# Altium schematic sheet LINE_PREAMP.SchDoc: =DocumentName
size 297 x 209 mm; CompanyName: "AS Manufacturing" LLC; Organization: "AS Manufacturing" LLC; Address1: 5 Sklyarenka St.; Address2: Kyiv 04073; Address3: Ukraine; Address4: https://ajax.systems/en/; DocumentNumber: 6; SheetNumber: 6; SheetTotal: 7; Template_version: 1.0.1
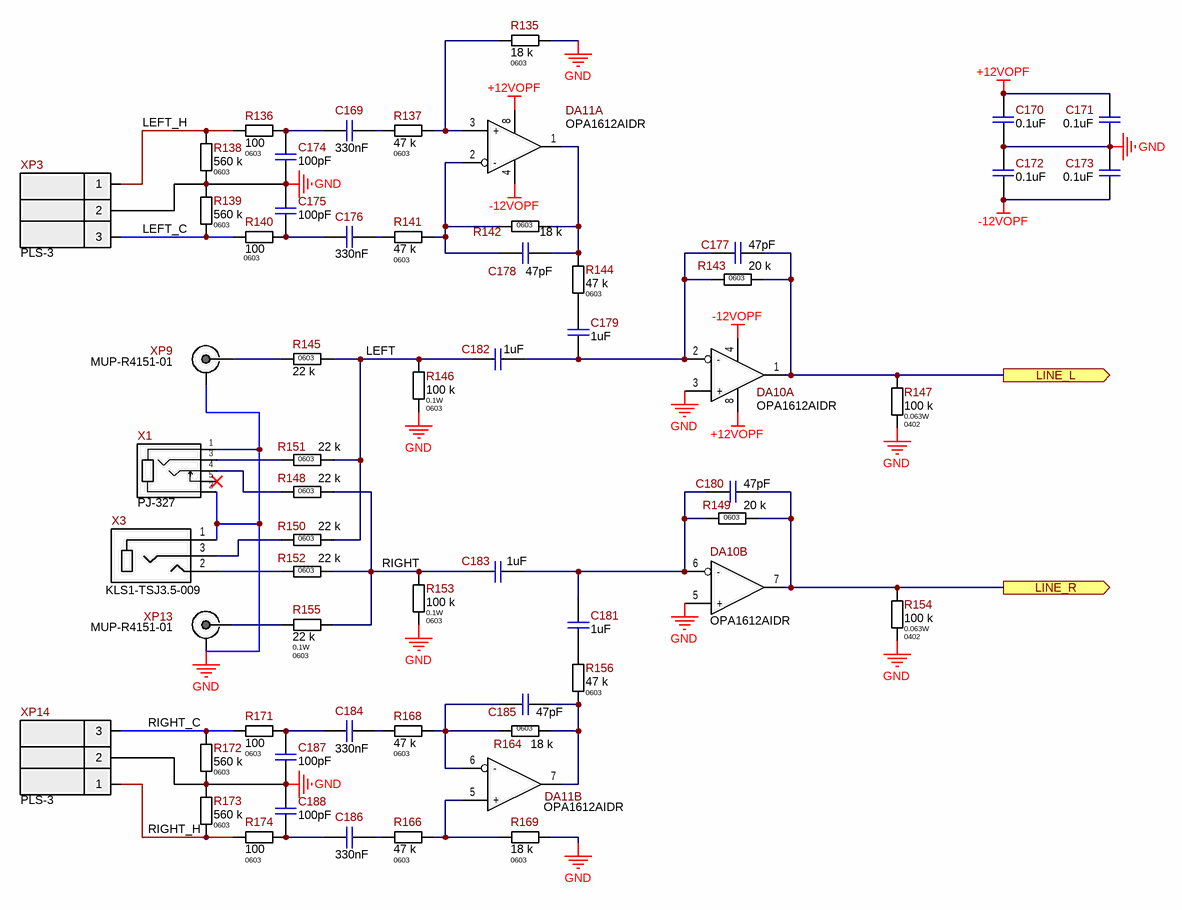
[diagram p0: LINE_PREAMP.SchDoc]

## Parts
C169  330nF  [WIMA_2,5x6,5x7,2]
C170  0.1uF  [C0402(1005)]
C171  0.1uF  [C0402(1005)]
C172  0.1uF  [C0402(1005)]
C173  0.1uF  [C0402(1005)]
C174  100pF  [C0402(1005)]
C175  100pF  [C0402(1005)]
C176  330nF  [WIMA_2,5x6,5x7,2]
C177  47pF  [C0603(1608)]
C178  47pF  [C0603(1608)]
C179  1uF  [WIMA5]
C180  47pF  [C0603(1608)]
C181  1uF  [WIMA5]
C182  1uF  [WIMA5]
C183  1uF  [WIMA5]
C184  330nF  [WIMA_2,5x6,5x7,2]
C185  47pF  [C0603(1608)]
C186  330nF  [WIMA_2,5x6,5x7,2]
C187  100pF  [C0402(1005)]
C188  100pF  [C0402(1005)]
DA10  OPA1612AIDR  [SOIC8]  (parts A,B of 2)
DA11  OPA1612AIDR  [SOIC8]  (parts A,B of 2)
R135  18 k  Package/Case: 0603  [R0603]
R136  100  Package/Case: 0603  [R0603]
R137  47 k  Package/Case: 0603  [R0603]
R138  560 k  Package/Case: 0603  [R0603]
R139  560 k  Package/Case: 0603  [R0603]
R140  100  Package/Case: 0603  [R0603]
R141  47 k  Package/Case: 0603  [R0603]
R142  18 k  Package/Case: 0603  [R0603]
R143  20 k  Package/Case: 0603  [R0603]
R144  47 k  Package/Case: 0603  [R0603]
R145  22 k  Package/Case: 0603  [R0603]
R146  100 k  Power Rating: 0.1W  Package/Case: 0603  [R0603]
R147  100 k  Power Rating: 0.063W  Package/Case: 0402  [R0402]
R148  22 k  Package/Case: 0603  [R0603]
R149  20 k  Package/Case: 0603  [R0603]
R150  22 k  Package/Case: 0603  [R0603]
R151  22 k  Package/Case: 0603  [R0603]
R152  22 k  Package/Case: 0603  [R0603]
R153  100 k  Power Rating: 0.1W  Package/Case: 0603  [R0603]
R154  100 k  Power Rating: 0.063W  Package/Case: 0402  [R0402]
R155  22 k  Power Rating: 0.1W  Package/Case: 0603  [R0603]
R156  47 k  Package/Case: 0603  [R0603]
R164  18 k  Package/Case: 0603  [R0603]
R166  47 k  Package/Case: 0603  [R0603]
R168  47 k  Package/Case: 0603  [R0603]
R169  18 k  Package/Case: 0603  [R0603]
R171  100  Package/Case: 0603  [R0603]
R172  560 k  Package/Case: 0603  [R0603]
R173  560 k  Package/Case: 0603  [R0603]
R174  100  Package/Case: 0603  [R0603]
X1  PJ-327  [PJ-327A]
X3  (no value)  [KLS1-TSJ3.5-009]
XP3  PLS-3  [3x-2.54]
XP9  MUP-R4151-01  [U.FL-R-SMT(10)_REC]
XP13  MUP-R4151-01  [U.FL-R-SMT(10)_REC]
XP14  PLS-3  [3x-2.54]

## Ports
LINE_L (out), LINE_R (out)

## Nets
+12VOPF: C170.1 C171.1 DA10.8(V+) DA11.8(V+)
-12VOPF: C172.2 C173.2 DA10.4(V-) DA11.4(V-)
GND: C170.2 C171.2 C172.1 C173.1 C174.2 C175.2 C187.2 C188.2 DA10.3(+) DA10.5(+) R135.1 R138.2 R139.1 R146.2 R147.2 R153.2 R154.2 R169.1 R172.1 R173.2 X1.1(GND) X1.2(GND) X3.1 XP3.2 XP9.2 XP13.2 XP14.2
LEFT: C182.1 R145.2 R146.1 R150.2 R151.2
LEFT_C: R139.2 R140.2 XP3.3
LEFT_H: R136.2 R138.1 XP3.1
LINE_L: C177.1 DA10.1(Out) R143.2 R147.1 ; port LINE_L
LINE_R: C180.1 DA10.7(Out) R149.2 R154.1 ; port LINE_R
RIGHT: C183.1 R148.2 R152.2 R153.1 R155.2
RIGHT_C: R171.2 R172.2 XP14.3
RIGHT_H: R173.1 R174.2 XP14.1
NetC169_1: C169.1 C174.1 R136.1
NetC169_2: C169.2 R137.1
NetC175_1: C175.1 C176.1 R140.1
NetC176_2: C176.2 R141.2
NetC177_2: C177.2 C179.2 C182.2 DA10.2(-) R143.1
NetC178_1: C178.1 DA11.1(Out) R142.1 R144.2
NetC178_2: C178.2 DA11.2(-) R141.1 R142.2
NetC179_1: C179.1 R144.1
NetC180_2: C180.2 C181.2 C183.2 DA10.6(-) R149.1
NetC181_1: C181.1 R156.1
NetC184_1: C184.1 C187.1 R171.1
NetC184_2: C184.2 R168.2
NetC185_1: C185.1 DA11.7(Out) R156.2 R164.1
NetC185_2: C185.2 DA11.6(-) R164.2 R168.1
NetC186_1: C186.1 C188.1 R174.1
NetC186_2: C186.2 R166.1
NetDA11_3: DA11.3(+) R135.2 R137.2
NetDA11_5: DA11.5(+) R166.2 R169.2
NetR145_1: R145.1 XP9.1
NetR148_1: R148.1 X1.4(GND)
NetR150_1: R150.1 X3.3
NetR151_1: R151.1 X1.3(GND)
NetR152_1: R152.1 X3.2
NetR155_1: R155.1 XP13.1

Not connected (* = marked no-connect by the designer): X1 5(GND)*

## Notes on the sheet
- 1
- 2
- 3
- 4
- 5
- 6
- C
- D
- E
- F
- Назва проекту
- Мова
- UA
- Розробник
- Формат
- A4
- Версія
- Дата
- Лист
- /

## Library data of the parts
C169 C176 C184 C186 = 330nF  AC40V DC63V 2,5x6,5x7,2: WIMA 330NF, 40VAC, 63VDC: 5mm, ± 10%; Manufacturer P/N: MKS2-100N/63; Name Component: Polypropylene (PP), Metallized; Temperature Coefficient: pp; Library Path 1: Capacitors.SchLib; Part Number: 330nF  AC40V DC63V 2,5x6,5x7,2; Value: 330nF; Tolerance: 10%; Power (V/A): AC40V DC63V; Package/Case: 2,5x6,5x7,2; Manufacturer: WIMA; Supplier 1: kosmodrom; ComponentLink1Description: Datasheet
C170-C173 = 0.1uF  25V C0402: CAP CER 0.1UF 25V X7R 0603; Manufacturer: Samsung Electro-Mechanics; Name Component: Capacitor Ceramic; Tolerance: ±10%; Operation Temperature: -55°C ~ 125°C; Library Path 1: Capacitors.SchLib; Part Number: 0.1uF  25V C0402; Value: 0.1uF; Temperature Coefficient: X7R; Power (V/A): 25V; Package/Case: C0402; Supplier Part Number 1: 1276-6854-2-ND; ComponentLink1Description: Datasheet
C174 C175 C187 C188 = 100pF  50V C0402: CAP CER 100PF 50V NP0 0402; Manufacturer: AVX Corporation; Name Component: Capacitor Ceramic; Tolerance: ±0.25pF; Operation Temperature: -55°C ~ 105°C; Temperature Coefficient: C0G, NP0; Library Path 1: Capacitors.SchLib; Part Number: 100pF  50V C0402; Value: 100pF; Power (V/A): 50V; Package/Case: C0402; Supplier 1: Digi-key; ComponentLink1Description: Datasheet
C177 C178 C180 C185 = 47pF  50V C0603: CAP CER 47PF 50V X7R 0603; Manufacturer: AVX Corporation; Manufacturer P/N: 06035C470KAT2A; Name Component: Capacitor Ceramic; Tolerance: ±10%; Operation Temperature: -55°C ~ 105°C; Library Path 1: Capacitors.SchLib; Part Number: 47pF  50V C0603; Value: 47pF; Temperature Coefficient: X7R; Power (V/A): 50V; Package/Case: C0603; Supplier 1: Digi-key; ComponentLink1Description: Datasheet; Supplier Part Number 1: 06035C470KAT2A-ND; ComponentLink1URL: http://catalogs.avx.com/SurfaceMount.pdf
C179 C181-C183 = 1uF  30В AC, 50В DC 5.5x10x7, 2мм: CAP FILM 1UF 10% 100VDC; Manufacturer: WIMA; Manufacturer P/N: MKS2-1U/50-R; Name Component: Polypropylene (PP), Metallized; Operation Temperature: -55°C ~ 125°C; Library Path 1: Capacitors.SchLib; Part Number: 1uF  30В AC, 50В DC 5.5x10x7, 2мм; Value: 1uF; Tolerance: ±10%; Power (V/A): 30В AC, 50В DC; Package/Case: 5.5x10x7, 2мм; Supplier 1: kosmodrom; ComponentLink1Description: Datasheet
DA10 DA11 = OPA1612AIDR: Audio Amplifier 2 Circuit Rail-to-Rail 8-SOIC; Manufacturer: Texas Instruments; Name Component: Operational amplifier; Operation Temperature: -40°C ~ 85°C; Power (V/A): 4.5V-36; Library Path 1: Integrated Circuit.SchLib; ComponentLink1URL: https://www.ti.com/general/docs/suppproductinfo.tsp?distId=10&gotoUrl=https%3A%2F%2Fwww.ti.com%2Flit%2Fgpn%2Fopa1611; ComponentLink1Description: Datasheet; Part Number: OPA1612AIDR; Value: OPA1612AIDR; Package/Case: 8-SOIC; Manufacturer P/N: OPA1612AIDR; Supplier 1: Digi-key; Supplier Part Number 1: 296-39098-6-ND
R135 R142 R164 R169 = 18 k  R0603: RES SMD 18 k OHM  ±1% 1/10W 0603; Power Rating: 0.1W; Name Component: Resistror; Operation Temperature: -55℃ to 155℃; Temperature Coefficient: ±100 ppm/°C; Library Path 1: Resistor.SchLib; Part Number: 18 k  R0603; Value: 18 k; Tolerance: ±1%
R136 R140 R171 R174 = 100  R0603: RES SMD 100 OHM  ±1% 1/10W 0603; Power Rating: 0.1W; Name Component: Resistror; Operation Temperature: -55℃ to 155℃; Temperature Coefficient: ±100 ppm/°C; Library Path 1: Resistor.SchLib; Part Number: 100  R0603; Value: 100; Tolerance: ±1%
R137 R141 R144 R156 R166 R168 = 47 k  R0603: RES SMD 47 k OHM  ±1% 1/10W 0603; Power Rating: 0.1W; Name Component: Resistror; Operation Temperature: -55℃ to 155℃; Temperature Coefficient: ±100 ppm/°C; Library Path 1: Resistor.SchLib; Part Number: 47 k  R0603; Value: 47 k; Tolerance: ±1%
R138 R139 R172 R173 = 560 k  R0603: RES SMD 560 k OHM  ±1% 1/10W 0603; Power Rating: 0.1W; Name Component: Resistror; Operation Temperature: -55℃ to 155℃; Temperature Coefficient: ±100 ppm/°C; Library Path 1: Resistor.SchLib; Part Number: 560 k  R0603; Value: 560 k; Tolerance: ±1%
R143 R149 = 20 k  R0603: RES SMD 20 k OHM  ±1% 1/10W 0603; Power Rating: 0.1W; Name Component: Resistror; Operation Temperature: -55℃ to 155℃; Temperature Coefficient: ±100 ppm/°C; Library Path 1: Resistor.SchLib; Part Number: 20 k  R0603; Value: 20 k; Tolerance: ±1%
R145 R148 R150-R152 = 22 k  R0603: RES SMD 22 k OHM  ±1% 1/10W 0603; Power Rating: 0.1W; Name Component: Resistror; Operation Temperature: -55℃ to 155℃; Temperature Coefficient: ±100 ppm/°C; Library Path 1: Resistor.SchLib; Part Number: 22 k  R0603; Value: 22 k; Tolerance: ±1%
R146 R153 = 100 k  R0603: RES SMD 100 k OHM  ±1% 1/10W 0603; Name Component: Resistror; Operation Temperature: -55℃ to 155℃; Temperature Coefficient: ±100 ppm/°C; Library Path 1: Resistor.SchLib; Part Number: 100 k  R0603; Value: 100 k; Tolerance: ±1%
R147 R154 = 100 k  R0402: RES SMD 100 k OHM  ±1% 1/16W 0402; Name Component: Resistror; Operation Temperature: -55℃ to 155℃; Temperature Coefficient: ±100 ppm/°C; Library Path 1: Resistor.SchLib; Part Number: 100 k  R0402; Value: 100 k; Tolerance: ±1%
R155 = 22 k  R0603: RES SMD 22 k OHM  ±1% 1/10W 0603; Name Component: Resistror; Operation Temperature: -55℃ to 155℃; Temperature Coefficient: ±100 ppm/°C; Library Path 1: Resistor.SchLib; Part Number: 22 k  R0603; Value: 22 k; Tolerance: ±1%
X1 = PJ-327: 3.5 Audio Jack SMD; Manufacturer_Name: Hongfa; Manufacturer_Part_Number: HFD31/5; Operation Temperature: #NAME?; Library Path 1: Connectors.SchLib; Datasheet Link: https://source.hongfa.com//Api/DownloadPdf/152; Height: 5.4mm; Arrow Part Number: HFD31/5; Arrow Price/Stock: https://www.arrow.com/en/products/hfd315/hongfa-europe-gmbh?region=europe; Part Number: PJ-327; Name Component: Audio Jack; Value: PJ-327; Supplier 1: Kosmodrom; ComponentLink1Description: Datasheet; ComponentLink1URL: https://e2e.ti.com/cfs-file/__key/communityserver-discussions-components-files/6/2.5_2D00_3.5_2D00_phone_2D00_jack.pdf
X3 = KLS1-TSJ3.5-009: 3.5mm DIP Stereo Jack, Right Angle, DC 30V, 0.5A, 2-20N Insertion Force; Manufacturer: KLS Electronic; Ajax_1C_ID: 80248; Ajax_1C_PN: Гніздо стерео 3,5мм на п/п (KLS1-TSJ3.5-009); Ajax_1С_Status: RND Only; Component Status: Released; Replacement: NONE; GUID_1C: 3459b50e-4b04-11ee-a36c-005056994834; Part Type: Audio Jack; Component Type: PTH; Temperature Range: -30ºC ~ 70ºC; ComponentLink1URL: \\altiumdb.ajax.local\files\Datasheet\Connectors\20120807134509KLS1-TSJ3.5-009.pdf; Price: 0.04; ComponentLink1Description: Datasheet; Part Number: KLS1-TSJ3.5-009
XP3 XP14 = PLS-3: CONN HEADER 3POS 2.54MM; Manufacturer: CONNFLY; Manufacturer P/N: DS1021-1*3SF11-B; Name Component: Rectangular Connectors - Headers; Operation Temperature: -0°C ~ 85°C; Power (V/A): 3А 150В; Library Path 1: Connectors.SchLib; Part Number: PLS-3; Value: PLS-3; Package/Case: 2.54mm; Supplier 1: Kosmodrom; ComponentLink1Description: Datasheet; ComponentLink1URL: https://static.chipdip.ru/lib/227/DOC000227157.pdf
XP9 XP13 = MUP-R4151-01: MHF Series Micro Coaxial Connector Receptacle, Vertical, 3.1x3.0x1.25mm; Name Component: U.FL Connector; Library Path 1: Connectors.SchLib; Part Number: MUP-R4151-01; Value: MUP-R4151-01; ComponentLink1Description: Datasheet; ComponentLink1URL: https://www.mupconnector.com/cnmobile/product/show/id/1842.html